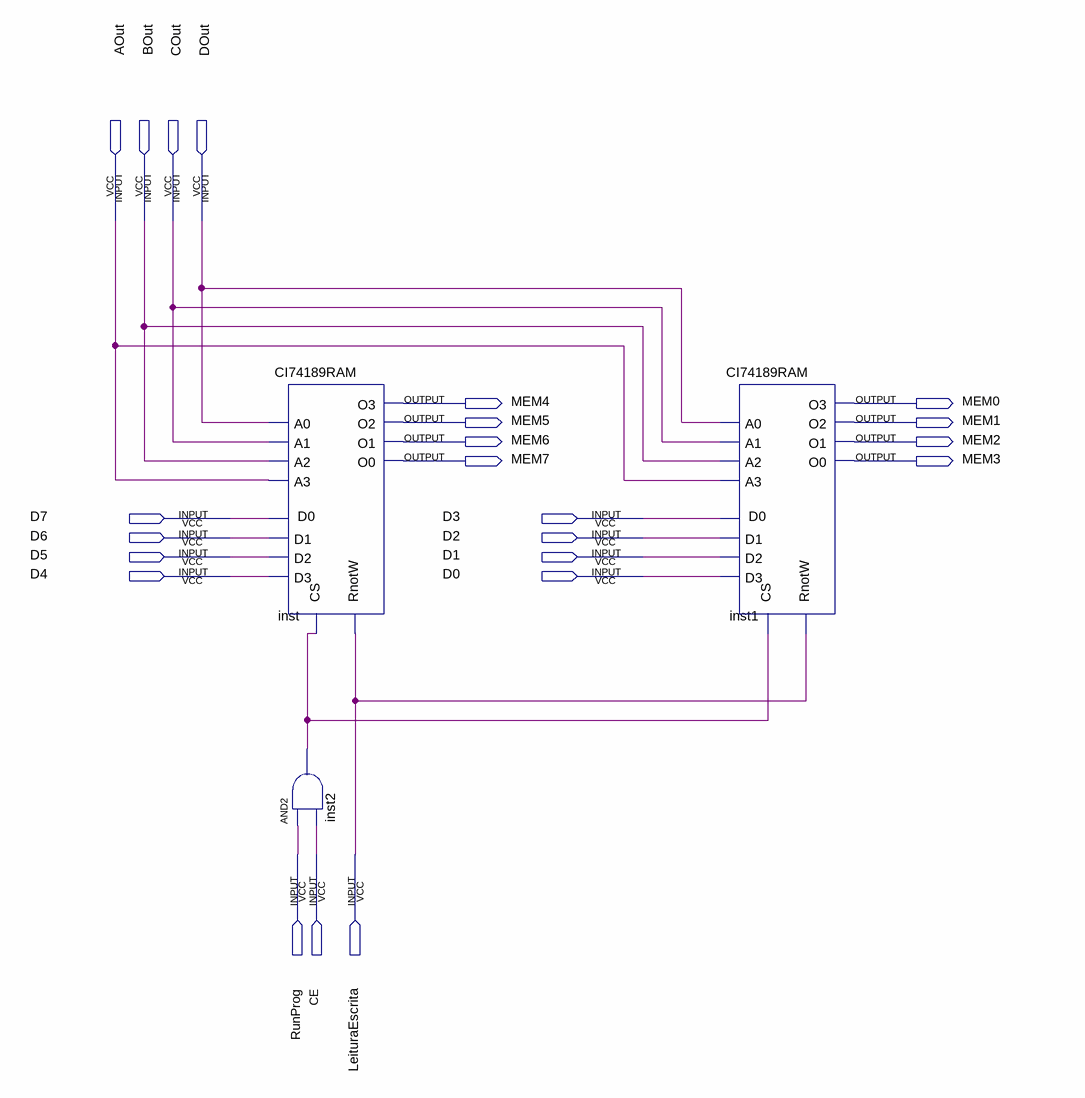
[diagram p0: schematic sheet]
// Quartus schematic RAM.bdf as structural Verilog: 3 symbols, 23 pins
module RAM (
  input  AOut,
  input  BOut,
  input  COut,
  input  DOut,
  input  D7,
  input  D3,
  input  D6,
  input  D2,
  input  D5,
  input  D1,
  input  D4,
  input  D0,
  input  RunProg,
  input  CE,
  input  LeituraEscrita,
  output MEM4,
  output MEM0,
  output MEM5,
  output MEM1,
  output MEM6,
  output MEM2,
  output MEM7,
  output MEM3
);

  wire inst2_out;

  CI74189RAM inst (
    .CS(inst2_out), .A0(DOut), .A1(COut), .A2(BOut), .A3(AOut), .RnotW(LeituraEscrita), .D1(D6), .D0(D7),
    .D2(D5), .D3(D4), .O3(MEM4), .O2(MEM5), .O1(MEM6), .O0(MEM7));
  and inst2 (inst2_out, RunProg, CE);
  CI74189RAM inst1 (
    .CS(inst2_out), .A0(DOut), .A1(COut), .A2(BOut), .A3(AOut), .RnotW(LeituraEscrita), .D1(D2), .D0(D3),
    .D2(D1), .D3(D0), .O3(MEM0), .O2(MEM1), .O1(MEM2), .O0(MEM3));
endmodule
